# Altium project Kame_EXP_BRK.PrjPcb
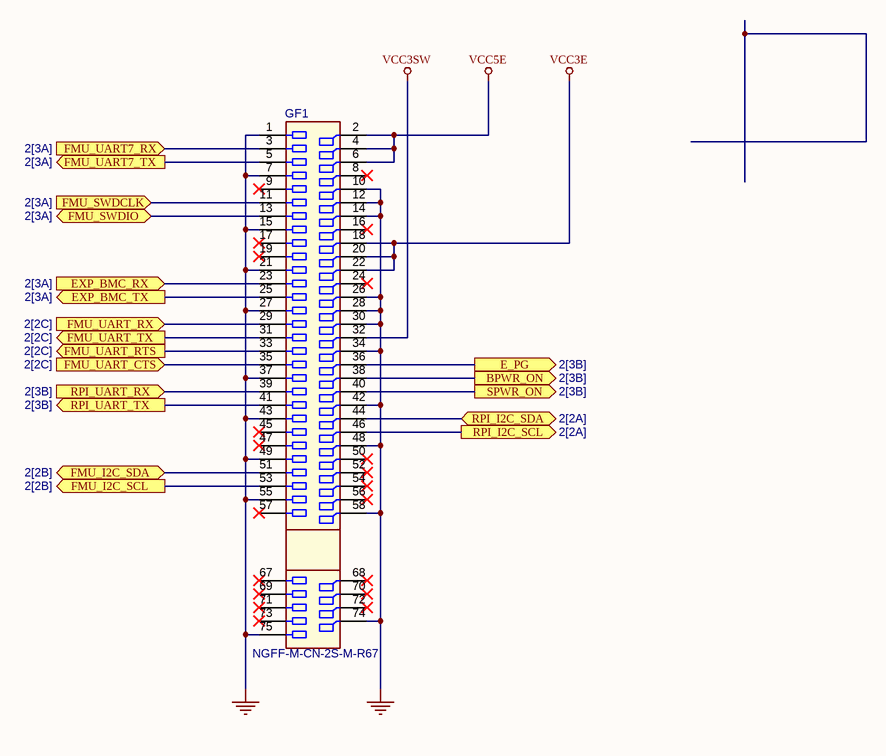
[diagram p0: 1_mb_conn.SchDoc]
Project: KAME_EXP_BRK; ProjectRev: 1
2 sheets, 48 parts. Net scope: flat (ports and power ports of the same name join across sheets).
Board file: Kame_EXP_BRK.PcbDoc
Sheets:
  1_mb_conn.SchDoc
  2_ext_conn.SchDoc

## Sheet 1_mb_conn.SchDoc: MB connector
size A4; Revision: 1; SheetNumber: 1; SheetTotal: 2

### Parts
GF1  NGFF-M-CN-2S-M-R67  [NGFF-M-GF-2D-500-1K-S67]  (no BOM)

### Ports
BPWR_ON (out, see 2[3B]), E_PG (out, see 2[3B]), EXP_BMC_RX (in, see 2[3A]), EXP_BMC_TX (out, see 2[3A]), FMU_I2C_SCL (out, see 2[2B]), FMU_I2C_SDA (bidir, see 2[2B]), FMU_SWDCLK (in, see 2[3A]), FMU_SWDIO (bidir, see 2[3A]), FMU_UART7_RX (in, see 2[3A]), FMU_UART7_TX (out, see 2[3A]), FMU_UART_CTS (in, see 2[2C]), FMU_UART_RTS (out, see 2[2C]), FMU_UART_RX (in, see 2[2C]), FMU_UART_TX (out, see 2[2C]), RPI_I2C_SCL (out, see 2[2A]), RPI_I2C_SDA (bidir, see 2[2A]), RPI_UART_RX (in, see 2[3B]), RPI_UART_TX (out, see 2[3B]), SPWR_ON (out, see 2[3B])

### Nets
GND: GF1.1 GF1.7 GF1.10 GF1.12 GF1.14 GF1.15 GF1.21 GF1.26 GF1.27 GF1.28 GF1.30 GF1.34 GF1.37 GF1.42 GF1.43 GF1.48 GF1.49 GF1.55 GF1.58 GF1.74 GF1.75
VCC3E: GF1.18 GF1.20 GF1.22
VCC3SW: GF1.32
VCC5E: GF1.2 GF1.4 GF1.6
BPWR_ON: GF1.38 ; port BPWR_ON
E_PG: GF1.36 ; port E_PG
EXP_BMC_RX: GF1.23 ; port EXP_BMC_RX
EXP_BMC_TX: GF1.25 ; port EXP_BMC_TX
FMU_I2C_SCL: GF1.53 ; port FMU_I2C_SCL
FMU_I2C_SDA: GF1.51 ; port FMU_I2C_SDA
FMU_SWDCLK: GF1.11 ; port FMU_SWDCLK
FMU_SWDIO: GF1.13 ; port FMU_SWDIO
FMU_UART7_RX: GF1.3 ; port FMU_UART7_RX
FMU_UART7_TX: GF1.5 ; port FMU_UART7_TX
FMU_UART_CTS: GF1.35 ; port FMU_UART_CTS
FMU_UART_RTS: GF1.33 ; port FMU_UART_RTS
FMU_UART_RX: GF1.29 ; port FMU_UART_RX
FMU_UART_TX: GF1.31 ; port FMU_UART_TX
RPI_I2C_SCL: GF1.46 ; port RPI_I2C_SCL
RPI_I2C_SDA: GF1.44 ; port RPI_I2C_SDA
RPI_UART_RX: GF1.39 ; port RPI_UART_RX
RPI_UART_TX: GF1.41 ; port RPI_UART_TX
SPWR_ON: GF1.40 ; port SPWR_ON

Not connected (* = marked no-connect by the designer): GF1 8* 9* 16* 17* 19* 24* 45* 47* 50* 52* 54* 56* 57* 67* 68* 69* 70* 71* 72* 73*

### Notes on the sheet
- Title
- Size:
- Date:
- A4
- Number:
- Time:
- Revision:
- Sheet
- of
- File:

### Library data of the parts
GF1 = CMP-002-00069-3: Golden finger, NGFF key M, Dual, Staggered, Pitch 0.5mm, 67-Position; Pins: 67

## Sheet 2_ext_conn.SchDoc: External connectors
size A3; Revision: 1; SheetNumber: 2; SheetTotal: 2
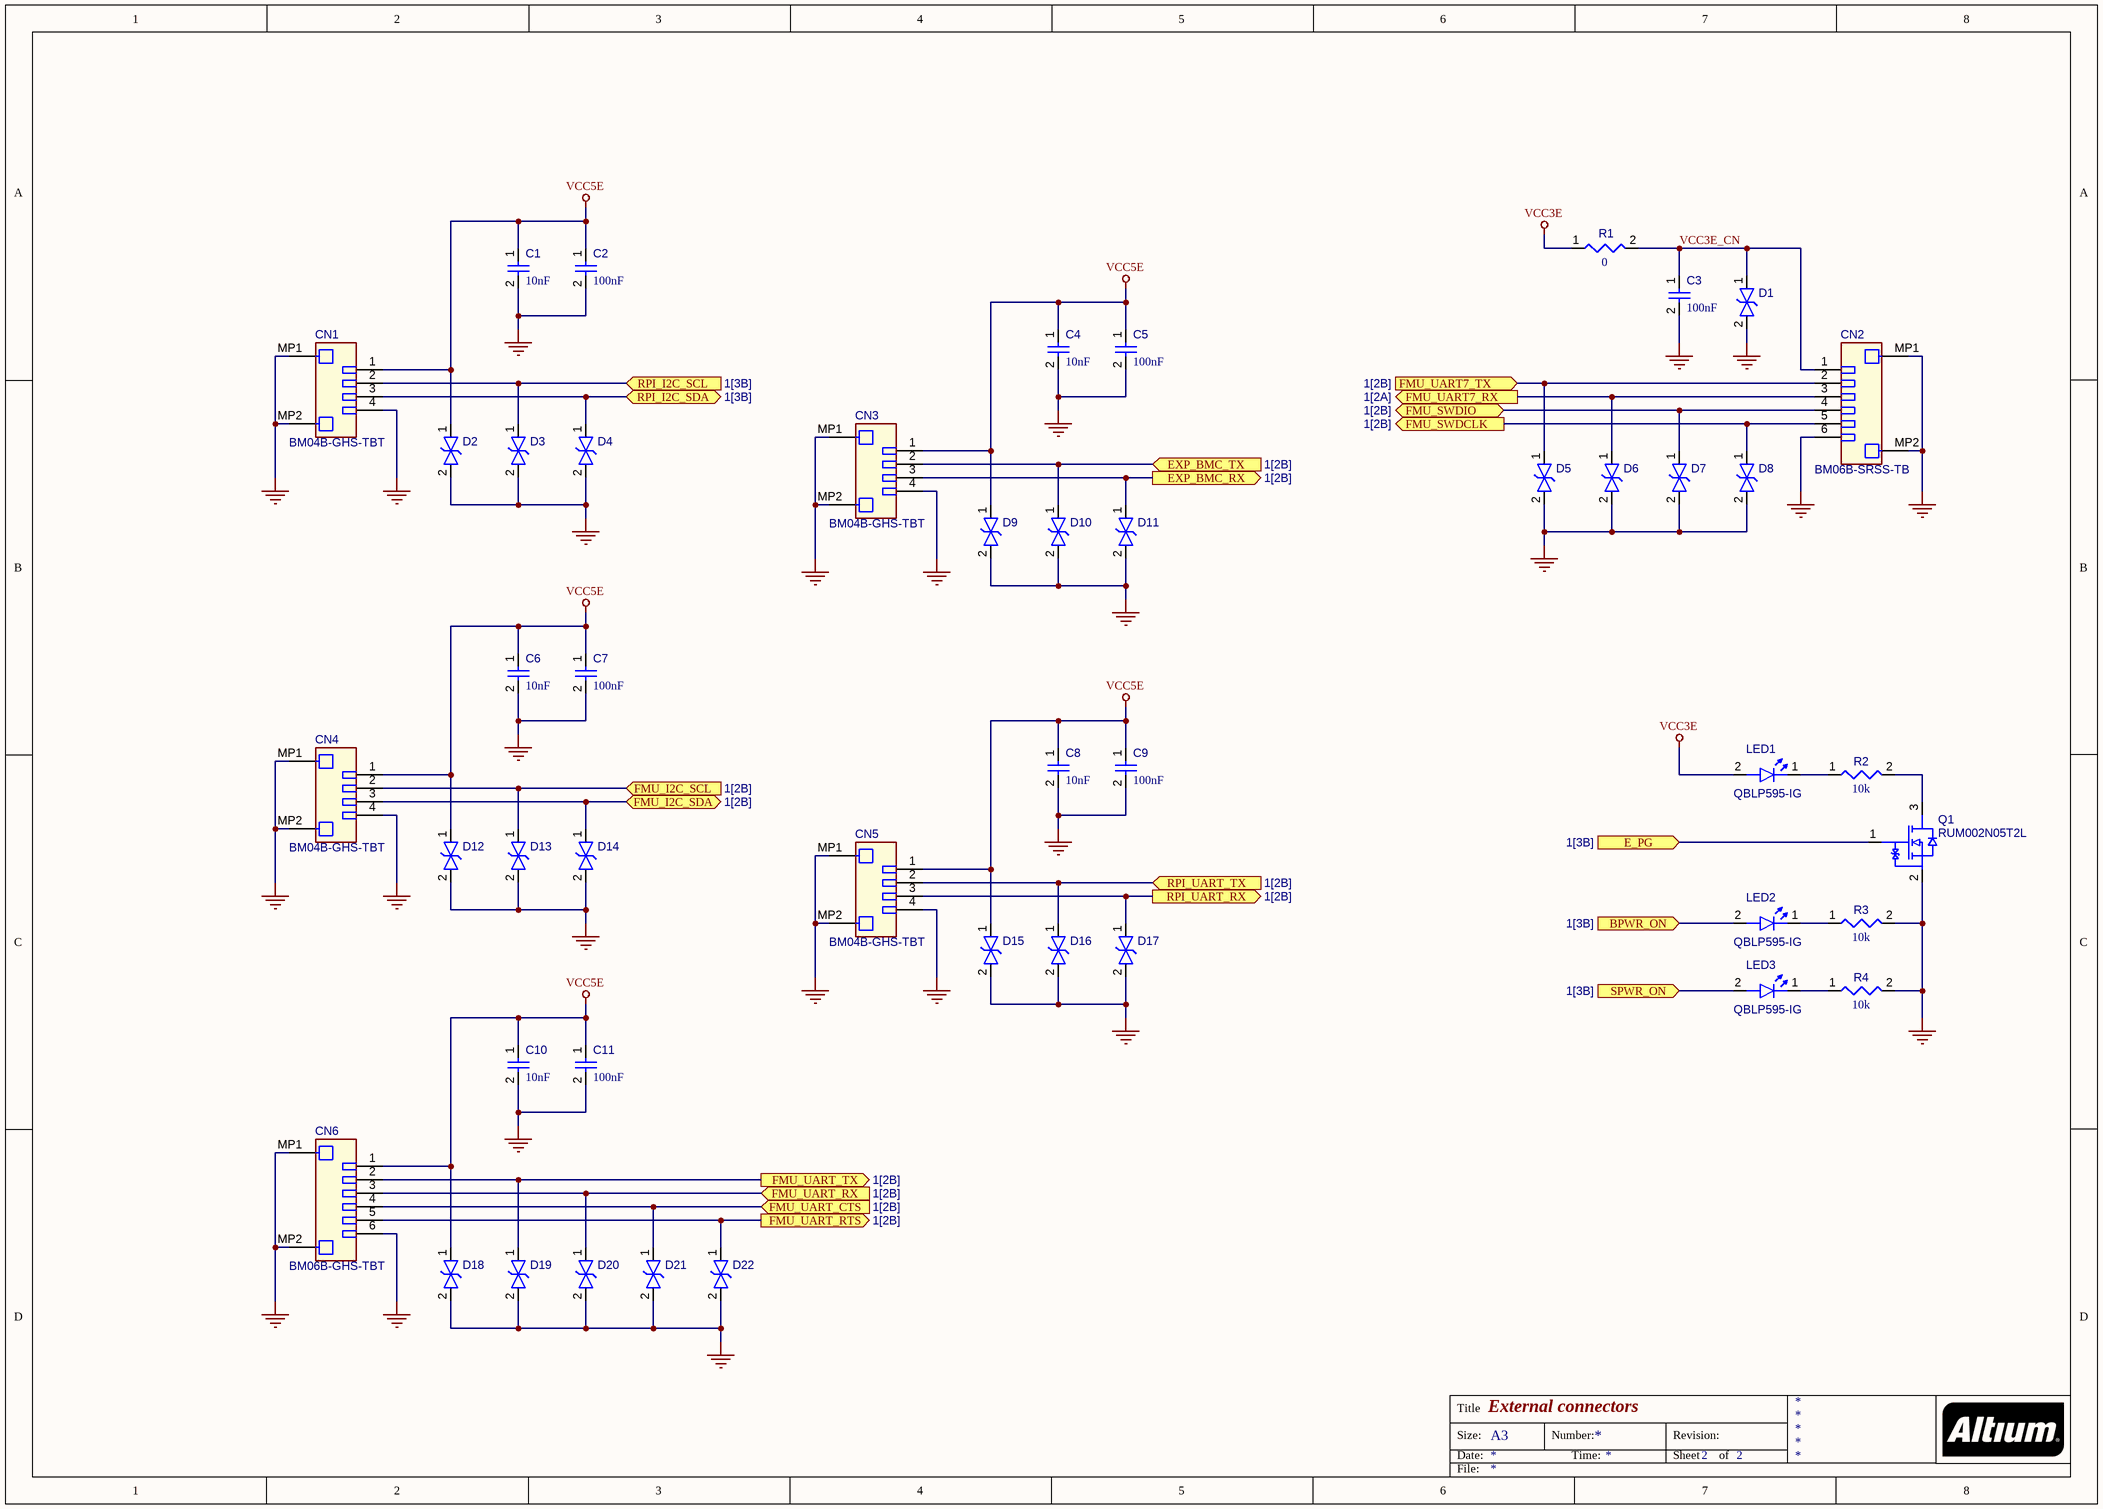
[diagram p1: 2_ext_conn.SchDoc]

### Parts
C1  value 10nF  [CAPC0402(1005)60_L]  (hidden comment: Capacitor 10nF +/-20% 50V 0402)
C2  value 100nF  [CAPC0402(1005)60_L]  (hidden comment: Capacitor 100nF +/-20% 10V 0402)
C3  value 100nF  [CAPC0402(1005)60_L]  (hidden comment: Capacitor 100nF +/-20% 10V 0402)
C4  value 10nF  [CAPC0402(1005)60_L]  (hidden comment: Capacitor 10nF +/-20% 50V 0402)
C5  value 100nF  [CAPC0402(1005)60_L]  (hidden comment: Capacitor 100nF +/-20% 10V 0402)
C6  value 10nF  [CAPC0402(1005)60_L]  (hidden comment: Capacitor 10nF +/-20% 50V 0402)
C7  value 100nF  [CAPC0402(1005)60_L]  (hidden comment: Capacitor 100nF +/-20% 10V 0402)
C8  value 10nF  [CAPC0402(1005)60_L]  (hidden comment: Capacitor 10nF +/-20% 50V 0402)
C9  value 100nF  [CAPC0402(1005)60_L]  (hidden comment: Capacitor 100nF +/-20% 10V 0402)
C10  value 10nF  [CAPC0402(1005)60_L]  (hidden comment: Capacitor 10nF +/-20% 50V 0402)
C11  value 100nF  [CAPC0402(1005)60_L]  (hidden comment: Capacitor 100nF +/-20% 10V 0402)
CN1  BM04B-GHS-TBT  [JST-BM04B-GHS-TBT_V]
CN2  BM06B-SRSS-TB  [JST-BM06B-SRSS-TB_V]
CN3  BM04B-GHS-TBT  [JST-BM04B-GHS-TBT_V]
CN4  BM04B-GHS-TBT  [JST-BM04B-GHS-TBT_V]
CN5  BM04B-GHS-TBT  [JST-BM04B-GHS-TBT_V]
CN6  BM06B-GHS-TBT  [JST-BM06B-GHS-TBT_V]
D1  ESDALC5-1BM2  [STM-SOD-882_V]  (value not drawn)
D2  ESDALC5-1BM2  [STM-SOD-882_V]  (value not drawn)
D3  ESDALC5-1BM2  [STM-SOD-882_V]  (value not drawn)
D4  ESDALC5-1BM2  [STM-SOD-882_V]  (value not drawn)
D5  ESDALC5-1BM2  [STM-SOD-882_V]  (value not drawn)
D6  ESDALC5-1BM2  [STM-SOD-882_V]  (value not drawn)
D7  ESDALC5-1BM2  [STM-SOD-882_V]  (value not drawn)
D8  ESDALC5-1BM2  [STM-SOD-882_V]  (value not drawn)
D9  ESDALC5-1BM2  [STM-SOD-882_V]  (value not drawn)
D10  ESDALC5-1BM2  [STM-SOD-882_V]  (value not drawn)
D11  ESDALC5-1BM2  [STM-SOD-882_V]  (value not drawn)
D12  ESDALC5-1BM2  [STM-SOD-882_V]  (value not drawn)
D13  ESDALC5-1BM2  [STM-SOD-882_V]  (value not drawn)
D14  ESDALC5-1BM2  [STM-SOD-882_V]  (value not drawn)
D15  ESDALC5-1BM2  [STM-SOD-882_V]  (value not drawn)
D16  ESDALC5-1BM2  [STM-SOD-882_V]  (value not drawn)
D17  ESDALC5-1BM2  [STM-SOD-882_V]  (value not drawn)
D18  ESDALC5-1BM2  [STM-SOD-882_V]  (value not drawn)
D19  ESDALC5-1BM2  [STM-SOD-882_V]  (value not drawn)
D20  ESDALC5-1BM2  [STM-SOD-882_V]  (value not drawn)
D21  ESDALC5-1BM2  [STM-SOD-882_V]  (value not drawn)
D22  ESDALC5-1BM2  [STM-SOD-882_V]  (value not drawn)
LED1  QBLP595-IG  [QTB-QBLP595_V]
LED2  QBLP595-IG  [QTB-QBLP595_V]
LED3  QBLP595-IG  [QTB-QBLP595_V]
Q1  RUM002N05T2L  [ROHM-SOT723-3_V]
R1  value 0  [RESC0603(1608)_L]  (hidden comment: Jumper 0603)
R2  value 10k  [RESC0402(1005)_L]  (hidden comment: Resistor 10K  +/-1 % 0402 63 mW)
R3  value 10k  [RESC0402(1005)_L]  (hidden comment: Resistor 10K  +/-1 % 0402 63 mW)
R4  value 10k  [RESC0402(1005)_L]  (hidden comment: Resistor 10K  +/-1 % 0402 63 mW)

### Ports
BPWR_ON (in, see 1[3B]), E_PG (in, see 1[3B]), EXP_BMC_RX (out, see 1[2B]), EXP_BMC_TX (in, see 1[2B]), FMU_I2C_SCL (in, see 1[2B]), FMU_I2C_SDA (bidir, see 1[2B]), FMU_SWDCLK (out, see 1[2B]), FMU_SWDIO (bidir, see 1[2B]), FMU_UART7_RX (out, see 1[2A]), FMU_UART7_TX (in, see 1[2B]), FMU_UART_CTS (in, see 1[2B]), FMU_UART_RTS (out, see 1[2B]), FMU_UART_RX (in, see 1[2B]), FMU_UART_TX (out, see 1[2B]), RPI_I2C_SCL (in, see 1[3B]), RPI_I2C_SDA (bidir, see 1[3B]), RPI_UART_RX (out, see 1[2B]), RPI_UART_TX (in, see 1[2B]), SPWR_ON (in, see 1[3B])

### Nets
GND: C1.2 C2.2 C3.2 C4.2 C5.2 C6.2 C7.2 C8.2 C9.2 C10.2 C11.2 CN1.4 CN1.MP1 CN1.MP2 CN2.6 CN2.MP1 CN2.MP2 CN3.4 CN3.MP1 CN3.MP2 CN4.4 CN4.MP1 CN4.MP2 CN5.4 CN5.MP1 CN5.MP2 CN6.6 CN6.MP1 CN6.MP2 D1.2(A) D2.2(A) D3.2(A) D4.2(A) D5.2(A) D6.2(A) D7.2(A) D8.2(A) D9.2(A) D10.2(A) D11.2(A) D12.2(A) D13.2(A) D14.2(A) D15.2(A) D16.2(A) D17.2(A) D18.2(A) D19.2(A) D20.2(A) D21.2(A) D22.2(A) Q1.2(S) R3.2 R4.2
VCC3E: LED1.2(A) R1.1
VCC5E: C1.1 C2.1 C4.1 C5.1 C6.1 C7.1 C8.1 C9.1 C10.1 C11.1 CN1.1 CN3.1 CN4.1 CN5.1 CN6.1 D2.1(A) D9.1(A) D12.1(A) D15.1(A) D18.1(A)
BPWR_ON: LED2.2(A) ; port BPWR_ON
E_PG: Q1.1(G) ; port E_PG
EXP_BMC_RX: CN3.3 D11.1(A) ; port EXP_BMC_RX
EXP_BMC_TX: CN3.2 D10.1(A) ; port EXP_BMC_TX
FMU_I2C_SCL: CN4.2 D13.1(A) ; port FMU_I2C_SCL
FMU_I2C_SDA: CN4.3 D14.1(A) ; port FMU_I2C_SDA
FMU_SWDCLK: CN2.5 D8.1(A) ; port FMU_SWDCLK
FMU_SWDIO: CN2.4 D7.1(A) ; port FMU_SWDIO
FMU_UART7_RX: CN2.3 D6.1(A) ; port FMU_UART7_RX
FMU_UART7_TX: CN2.2 D5.1(A) ; port FMU_UART7_TX
FMU_UART_CTS: CN6.4 D21.1(A) ; port FMU_UART_CTS
FMU_UART_RTS: CN6.5 D22.1(A) ; port FMU_UART_RTS
FMU_UART_RX: CN6.3 D20.1(A) ; port FMU_UART_RX
FMU_UART_TX: CN6.2 D19.1(A) ; port FMU_UART_TX
RPI_I2C_SCL: CN1.2 D3.1(A) ; port RPI_I2C_SCL
RPI_I2C_SDA: CN1.3 D4.1(A) ; port RPI_I2C_SDA
RPI_UART_RX: CN5.3 D17.1(A) ; port RPI_UART_RX
RPI_UART_TX: CN5.2 D16.1(A) ; port RPI_UART_TX
SPWR_ON: LED3.2(A) ; port SPWR_ON
VCC3E_CN: C3.1 CN2.1 D1.1(A) R1.2
NetLED1_1: LED1.1(K) R2.1
NetLED2_1: LED2.1(K) R3.1
NetLED3_1: LED3.1(K) R4.1
NetQ1_3: Q1.3(D) R2.2

### Notes on the sheet
- Title
- Size:
- Date:
- A3
- Number:
- Time:
- Revision:
- Sheet
- of
- File:

### Library data of the parts
C1 C4 C6 C8 C10 = CMP-001-00069-3: Chip Capacitor, 10nF +/-20%, 50V, 0402, Thickness 0.6 mm; Tolerance: 5%; Voltage Rating: 50V; Mounting Technology: SMT; Pins: 2; Case/Package: 0402; Max Operating Temperature: 85°C; Min Operating Temperature: -55°C
C2 C3 C5 C7 C9 C11 = CMP-001-00061-3: Chip Capacitor, 100nF +/-20%, 10V, 0402, Thickness 0.6 mm; Tolerance: 20%; Min Operating Temperature: -55°C; Case/Package: 0402; Voltage Rating: 10V; Pins: 2; Mounting Technology: SMT; Max Operating Temperature: 85°C
CN1 CN3-CN5 = CMP-002-00053-3: Header, Pitch 1.25 mm, 1 x 4 Position, Height 4.05 mm, -25 to 85 degC; Pins: 6
CN2 = CMP-002-00052-3: Header, Pitch 1 mm, 1 x 6 Position, Height 4.25 mm, -25 to 85 degC; Connector Type: Header,Shrouded; Pins: 8
CN6 = CMP-002-00054-4: Header, Pitch 1.25 mm, 1 x 6 Position, Height 4.05 mm, -25 to 85 degC; Pins: 8
D1-D22 = CMP-004-00030-3: Single Line Low Capacitance Transil™, 5 V, -55 to 150 degC, 2-Pin SOD-882, RoHS, Tape and Reel; Mounting Technology: SMT; Pins: 2
LED1-LED3 = CMP-007-00041-3: Chip LED 0402, Green, 0.02 A, 3.1 to 3.7 V, -40 to 80 degC, 2-Pin SMD, RoHS, Tape and Reel; Mounting Technology: SMT; Pins: 2; Case/Package: 0402; RoHS Compliant: Yes; Colour: Green
Q1 = CMP-013-00026-2: Nch Small Signal MOSFET, 50 V, 200 mA, 3-Pin SOT723, RoHS, Tape and Reel; Vgs(th) (Max) @ Id: 1V@1mA; Pins: 3
R1 = CMP-009-00175-3: Case/Package: 0603; Max Operating Temperature: 155°C; Min Operating Temperature: -55°C; Pins: 2
R2-R4 = CMP-009-00149-3: Chip Resistor, 10 kOhms, +/-1 %, 63 mW, -55 to 125 degC, 0402; Tolerance: 1%; Power: 63mW; Case/Package: 0402; Max Operating Temperature: 155°C; Min Operating Temperature: -55°C; Pins: 2

## Nets that join several sheets
GND: 1_mb_conn (21 pins), 2_ext_conn (54 pins)
VCC3E: 1_mb_conn (GF1.18 GF1.20 GF1.22), 2_ext_conn (LED1.2 R1.1)
VCC5E: 1_mb_conn (GF1.2 GF1.4 GF1.6), 2_ext_conn (20 pins)
BPWR_ON: 1_mb_conn (GF1.38), 2_ext_conn (LED2.2)
E_PG: 1_mb_conn (GF1.36), 2_ext_conn (Q1.1)
EXP_BMC_RX: 1_mb_conn (GF1.23), 2_ext_conn (CN3.3 D11.1)
EXP_BMC_TX: 1_mb_conn (GF1.25), 2_ext_conn (CN3.2 D10.1)
FMU_I2C_SCL: 1_mb_conn (GF1.53), 2_ext_conn (CN4.2 D13.1)
FMU_I2C_SDA: 1_mb_conn (GF1.51), 2_ext_conn (CN4.3 D14.1)
FMU_SWDCLK: 1_mb_conn (GF1.11), 2_ext_conn (CN2.5 D8.1)
FMU_SWDIO: 1_mb_conn (GF1.13), 2_ext_conn (CN2.4 D7.1)
FMU_UART7_RX: 1_mb_conn (GF1.3), 2_ext_conn (CN2.3 D6.1)
FMU_UART7_TX: 1_mb_conn (GF1.5), 2_ext_conn (CN2.2 D5.1)
FMU_UART_CTS: 1_mb_conn (GF1.35), 2_ext_conn (CN6.4 D21.1)
FMU_UART_RTS: 1_mb_conn (GF1.33), 2_ext_conn (CN6.5 D22.1)
FMU_UART_RX: 1_mb_conn (GF1.29), 2_ext_conn (CN6.3 D20.1)
FMU_UART_TX: 1_mb_conn (GF1.31), 2_ext_conn (CN6.2 D19.1)
RPI_I2C_SCL: 1_mb_conn (GF1.46), 2_ext_conn (CN1.2 D3.1)
RPI_I2C_SDA: 1_mb_conn (GF1.44), 2_ext_conn (CN1.3 D4.1)
RPI_UART_RX: 1_mb_conn (GF1.39), 2_ext_conn (CN5.3 D17.1)
RPI_UART_TX: 1_mb_conn (GF1.41), 2_ext_conn (CN5.2 D16.1)
SPWR_ON: 1_mb_conn (GF1.40), 2_ext_conn (LED3.2)